# Altium schematic sheet Top.SchDoc
size A
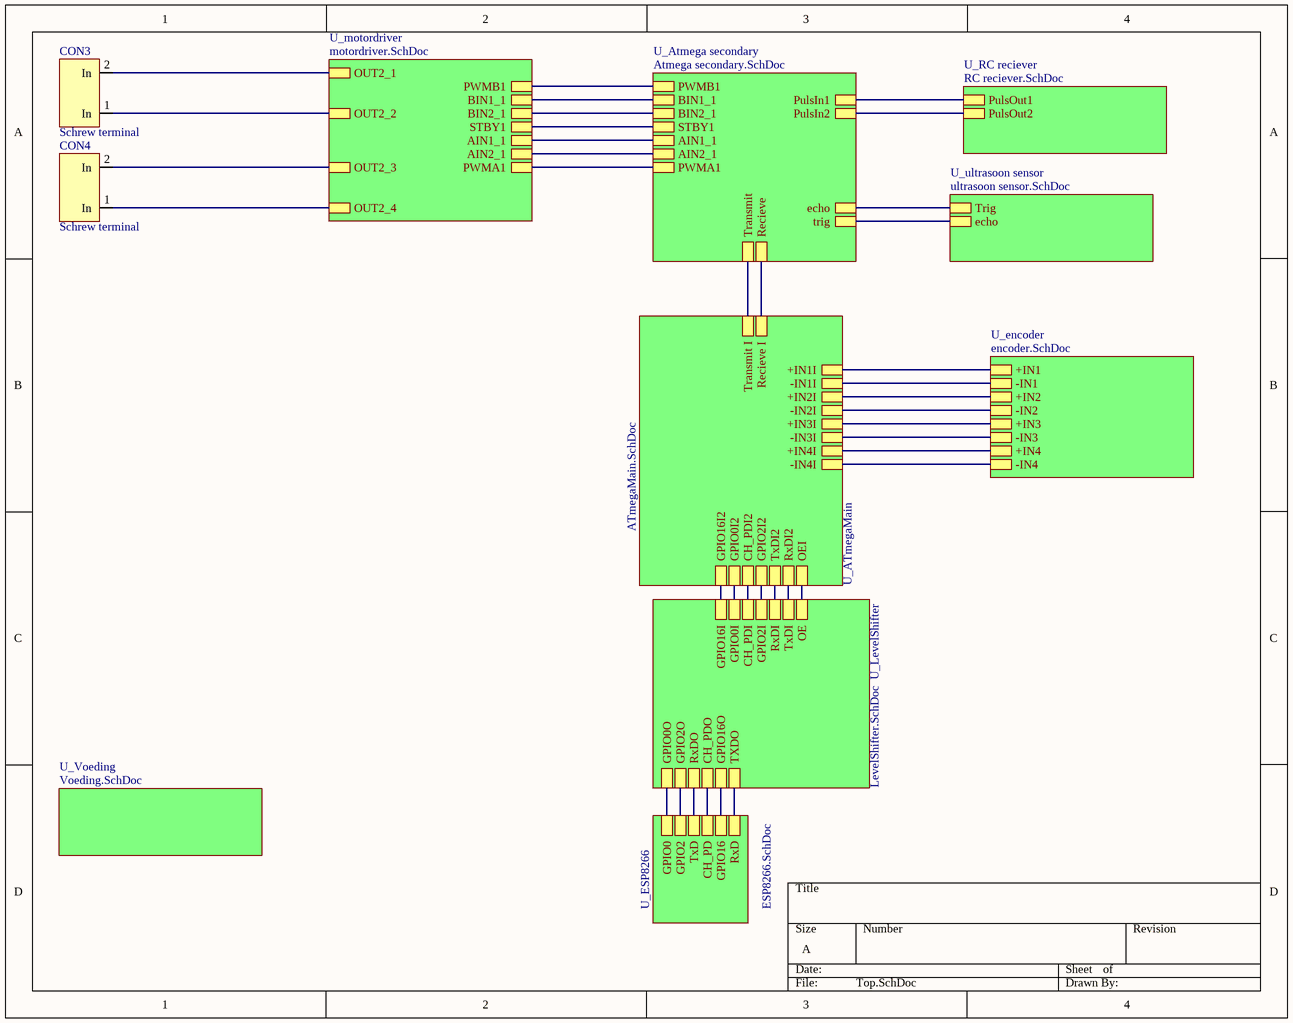
[diagram p0: Top.SchDoc]

## Parts
CON3  Schrew terminal  [ScrewTerminal]
CON4  Schrew terminal  [ScrewTerminal]

## Sub-sheets
U_Atmega secondary = Atmega secondary.SchDoc: PWMB1, BIN1_1, BIN2_1, STBY1, AIN1_1, AIN2_1, PWMA1, Transmit, Recieve, PulsIn1, PulsIn2, echo, trig
U_ATmegaMain = ATmegaMain.SchDoc: Recieve I, Transmit I, RxDI2, TxDI2, GPIO16I2, GPIO0I2, CH_PDI2, GPIO2I2, OEI, +IN1I, -IN1I, +IN2I, -IN2I, +IN3I, -IN3I, +IN4I, -IN4I
U_encoder = encoder.SchDoc: +IN1, -IN1, +IN2, -IN2, +IN3, -IN3, +IN4, -IN4
U_ESP8266 = ESP8266.SchDoc: RxD, GPIO16, CH_PD, TxD, GPIO2, GPIO0
U_LevelShifter = LevelShifter.SchDoc: RxDI, GPIO16I, GPIO0I, CH_PDI, GPIO2I, TxDI, RxDO, GPIO16O, GPIO0O, CH_PDO, GPIO2O, TXDO, OE
U_motordriver = motordriver.SchDoc: PWMA1, AIN2_1, AIN1_1, STBY1, BIN1_1, BIN2_1, PWMB1, OUT2_1, OUT2_2, OUT2_3, OUT2_4
U_RC reciever = RC reciever.SchDoc: PulsOut1, PulsOut2
U_ultrasoon sensor = ultrasoon sensor.SchDoc: Trig, echo
U_Voeding = Voeding.SchDoc: no entries

## Nets
NetCON3_1: CON3.1(In) ; sheet U_motordriver/OUT2_2
NetCON3_2: CON3.2(In) ; sheet U_motordriver/OUT2_1
NetCON4_1: CON4.1(In) ; sheet U_motordriver/OUT2_4
NetCON4_2: CON4.2(In) ; sheet U_motordriver/OUT2_3
(unnamed): sheet U_ATmegaMain/Recieve I, sheet U_Atmega secondary/Recieve
(unnamed): sheet U_ATmegaMain/Transmit I, sheet U_Atmega secondary/Transmit
(unnamed): sheet U_ATmegaMain/RxDI2, sheet U_LevelShifter/TxDI
(unnamed): sheet U_ATmegaMain/TxDI2, sheet U_LevelShifter/RxDI
(unnamed): sheet U_ATmegaMain/GPIO16I2, sheet U_LevelShifter/GPIO16I
(unnamed): sheet U_ATmegaMain/GPIO0I2, sheet U_LevelShifter/GPIO0I
(unnamed): sheet U_ATmegaMain/CH_PDI2, sheet U_LevelShifter/CH_PDI
(unnamed): sheet U_ATmegaMain/GPIO2I2, sheet U_LevelShifter/GPIO2I
(unnamed): sheet U_ATmegaMain/OEI, sheet U_LevelShifter/OE
(unnamed): sheet U_ATmegaMain/+IN1I, sheet U_encoder/+IN1
(unnamed): sheet U_ATmegaMain/-IN1I, sheet U_encoder/-IN1
(unnamed): sheet U_ATmegaMain/+IN2I, sheet U_encoder/+IN2
(unnamed): sheet U_ATmegaMain/-IN2I, sheet U_encoder/-IN2
(unnamed): sheet U_ATmegaMain/+IN3I, sheet U_encoder/+IN3
(unnamed): sheet U_ATmegaMain/-IN3I, sheet U_encoder/-IN3
(unnamed): sheet U_ATmegaMain/+IN4I, sheet U_encoder/+IN4
(unnamed): sheet U_ATmegaMain/-IN4I, sheet U_encoder/-IN4
(unnamed): sheet U_Atmega secondary/PWMB1, sheet U_motordriver/PWMB1
(unnamed): sheet U_Atmega secondary/BIN1_1, sheet U_motordriver/BIN1_1
(unnamed): sheet U_Atmega secondary/BIN2_1, sheet U_motordriver/BIN2_1
(unnamed): sheet U_Atmega secondary/STBY1, sheet U_motordriver/STBY1
(unnamed): sheet U_Atmega secondary/AIN1_1, sheet U_motordriver/AIN1_1
(unnamed): sheet U_Atmega secondary/AIN2_1, sheet U_motordriver/AIN2_1
(unnamed): sheet U_Atmega secondary/PWMA1, sheet U_motordriver/PWMA1
(unnamed): sheet U_Atmega secondary/PulsIn1, sheet U_RC reciever/PulsOut1
(unnamed): sheet U_Atmega secondary/PulsIn2, sheet U_RC reciever/PulsOut2
(unnamed): sheet U_Atmega secondary/echo, sheet U_ultrasoon sensor/Trig
(unnamed): sheet U_Atmega secondary/trig, sheet U_ultrasoon sensor/echo
(unnamed): sheet U_ESP8266/RxD, sheet U_LevelShifter/TXDO
(unnamed): sheet U_ESP8266/GPIO16, sheet U_LevelShifter/GPIO16O
(unnamed): sheet U_ESP8266/CH_PD, sheet U_LevelShifter/CH_PDO
(unnamed): sheet U_ESP8266/TxD, sheet U_LevelShifter/RxDO
(unnamed): sheet U_ESP8266/GPIO2, sheet U_LevelShifter/GPIO2O
(unnamed): sheet U_ESP8266/GPIO0, sheet U_LevelShifter/GPIO0O